# Altium schematic sheet USB suply_UART bridge.SchDoc
size A4; SheetNumber: 7; SheetTotal: 10
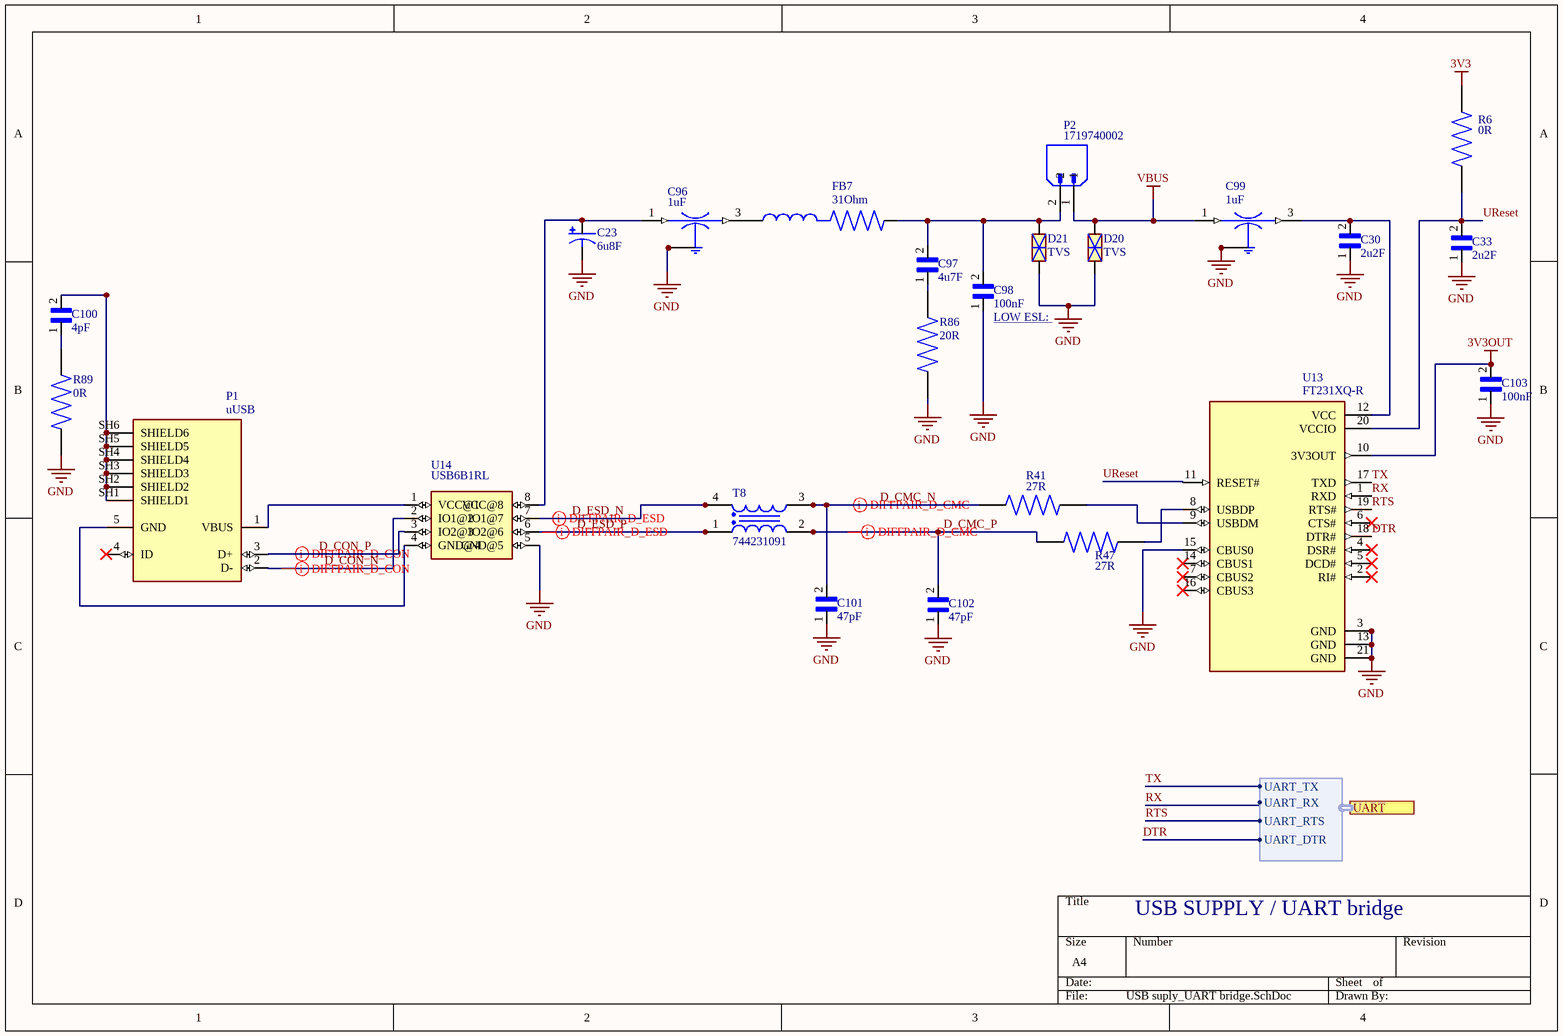
[diagram p0: USB suply_UART bridge.SchDoc]

## Parts
C23  6u8F  [2917(POL)]
C30  2u2F  [CAPC0603X35N]
C33  2u2F  [CAPC0603X35N]
C96  1uF  [FIL_NFM21PC105B1A3D]
C97  4u7F  [CAPC1608X100N]
C98  100nF  [CAPC0510X35N]
C99  1uF  [FIL_NFM21PC105B1A3D]
C100  4pF  [CAPC1005X55N]
C101  47pF  [CAPC1005X55N]
C102  47pF  [CAPC1005X55N]
C103  100nF  [CAPC0603X33N]
D20  TVS  [ST0201]
D21  TVS  [ST0201]
FB7  31Ohm  [FIL_NFZ32BW310HN11L]
P1  uUSB  [MOLEX_1050170001]
P2  1719740002  [MOLEX_1719740002]
R6  0R  [RESC1005X37N]
R41  27R  [RESC1005X40N]
R47  27R  [RESC1005X40N]
R86  20R  [RESC1005X40N]
R89  0R  [RESC1005X37N]
T8  744231091  [WE-CNSW_0805]
U13  FT231XQ-R  [QFN50P400X400X80-21N]
U14  USB6B1RL  [SOIC8]

## Ports
UART (harness UART, see System Overview[1B], External interfaces and connections[1C], Microcontroller[1A])

## Harnesses
UART: UART_TX, UART_RX, UART_RTS, UART_DTR

## Nets
3V3: R6.2
3V3OUT: C103.2 U13.10(3V3OUT)
GND: C23.2(NEG) C30.1 C33.1 C96.2(GND) C96.2_1(GND) C96.2_2(GND) C96.2_3(GND) C96.2_4(GND) C98.1 C99.2(GND) C99.2_1(GND) C99.2_2(GND) C99.2_3(GND) C99.2_4(GND) C101.1 C102.1 C103.1 D20.1 D21.1 R86.1 R89.1 U13.3(GND) U13.13(GND) U13.15(CBUS0) U13.21(GND) U14.5(GND@5)
VBUS: C99.1(IN) D20.2 P2.1
D_CMC_N: C101.2 R41.1 T8.3
D_CMC_P: C102.2 R47.1 T8.2
D_CON_N: P1.2(D-) U14.2(IO1@2)
D_CON_P: P1.3(D+) U14.3(IO2@3)
D_ESD_N: T8.4 U14.7(IO1@7)
D_ESD_P: T8.1 U14.6(IO2@6)
DTR: U13.18(DTR#) ; port UART.UART_DTR
RTS: U13.19(RTS#) ; port UART.UART_RTS
RX: U13.1(RXD) ; port UART.UART_RX
TX: U13.17(TXD) ; port UART.UART_TX
UReset: C33.2 R6.1 U13.11(RESET#) U13.20(VCCIO)
NetC23_1: C23.1(POS) C96.1(IN) U14.8(VCC@8)
NetC30_2: C30.2 C99.3(OUT) U13.12(VCC)
NetC96_3: C96.3(OUT) FB7.1
NetC97_1: C97.1 R86.2
NetC97_2: C97.2 C98.2 D21.2 FB7.2 P2.2
NetC100_1: C100.1 R89.2
NetC100_2: C100.2 P1.SH1(SHIELD1) P1.SH2(SHIELD2) P1.SH3(SHIELD3) P1.SH4(SHIELD4) P1.SH5(SHIELD5) P1.SH6(SHIELD6)
NetP1_1: P1.1(VBUS) U14.1(VCC@1)
NetP1_5: P1.5(GND) U14.4(GND@4)
NetR41_2: R41.2 U13.9(USBDM)
NetR47_2: R47.2 U13.8(USBDP)

Not connected (* = marked no-connect by the designer): P1 4(ID)*; U13 2(RI#)* 4(DSR#)* 5(DCD#)* 6(CTS#)* 7(CBUS2)* 14(CBUS1)* 16(CBUS3)*

## Layout directives
differential pair; differential pair class D_CON: D_CON_N, D_CON_P
differential pair; differential pair class D_ESD: D_ESD_N, D_ESD_P
differential pair; differential pair class D_CMC: D_CMC_N, D_CMC_P

## Notes on the sheet
- USB SUPPLY / UART bridge

## Library data of the parts
C23 = ECASD41C685M070K00: 6.8 µF 16 V Aluminum - Polymer Capacitors 2917 (7343 Metric) 70mOhm 1000 Hrs @ 105°C; MF: Murata; SnapEDA_Link: https://www.snapeda.com/parts/ECASD41C685M070K00/Murata/view-part/?ref=snap; Package: 2917 Murata; Value: *; MP: ECASD41C685M070K00; Check_prices: https://www.snapeda.com/parts/ECASD41C685M070K00/Murata/view-part/?ref=eda
C30 C33 = GRM033R60J225ME15D: SMD Capacitor X5R(EIA) with Capacitance: 2.2uF Tol. 20%. Rated Voltage: 6.3Vdc; Package: None; Price: None; Value: *; MP: GRM033R60J225ME15D; Availability: Unavailable
C96 C99 = NFM21PC105B1A3D: SMD Capacitor with Capacitance: 1.0uF Tol. 20%. Rated Voltage: 10Vdc; MF: Murata; Value: *; Package: NONSTANDARD; Price: None; MP: NFM21PC105B1A3D; Availability: Unavailable; SnapEDA_Link: https://www.snapeda.com/parts/NFM21PC105B1A3D/Murata/view-part/4380627/?ref=snap
C97 = GRM188R61A475KE15D: SMD Capacitor X5R(EIA) with Capacitance: 4.7uF Tol. 10%. Rated Voltage: 10Vdc; MF: Murata; MP: GRM188R61A475KE15D; Value: *; Availability: Bad; Package: 1608 Murata; SnapEDA_Link: https://www.snapeda.com/parts/GRM188R61A475KE15D/Murata%20Electronics%20North%20America/view-part/523427/?ref=snap; Price: None
C98 = LLL153C80J104ME01E: SMD Capacitor X6S(EIA) with Capacitance: 0.10uF Tol. 20%. Rated Voltage: 6.3Vdc; MF: Murata; Price: None; Value: *; Purchase-URL: https://pricing.snapeda.com/search/part/LLL153C80J104ME01E/?ref=eda; Package: 0510 Murata; SnapEDA_Link: https://www.snapeda.com/parts/LLL153C80J104ME01E/Murata/view-part/4376162/?ref=snap; Availability: Good; MP: LLL153C80J104ME01E
C100 = GRM1555C1H4R0CA01D: Cap Ceramic 4pF 50V C0G 0.25pF SMD 0402 125Â°C Paper T/R; Package: None; Price: None; Value: *; MP: GRM1555C1H4R0CA01D; Availability: Unavailable
C101 C102 = GRM1555C1H470FA01D: CAP, MLCC, C0G, 47PF, 50V, 0402; Package: None; Price: None; Value: *; MP: GRM1555C1H470FA01D; Availability: Unavailable
C103 = GRM033C80J104KE15D: SMD capacitor X6S(EIA) with capacitance 0.10uF Tol.10%. Rated voltage 6.3Vdc 105C; MF: Murata Electronics; Availability: In Stock; SnapEDA_Link: https://www.snapeda.com/parts/GRM033C80J104KE15D/Murata+Electronics+North+America/view-part/?ref=snap; Price: None; Check_prices: https://www.snapeda.com/parts/GRM033C80J104KE15D/Murata+Electronics+North+America/view-part/?ref=eda; Package: 0603 Taiyo Yuden; Purchase-URL: https://pricing.snapeda.com/search/part/GRM033C80J104KE15D/?ref=eda; MP: GRM033C80J104KE15D; Value: *
D20 D21 = ESDAXLC6-1BU2: 17V Clamp 1A (8/20Âµs) Ipp Tvs Diode Surface Mount ST0201; MF: STMicroelectronics; SnapEDA_Link: https://www.snapeda.com/parts/ESDAXLC6-1BU2/STMicroelectronics/view-part/?ref=snap; Package: 0201 STMicroelectronics; Value: *; MP: ESDAXLC6-1BU2; Check_prices: https://www.snapeda.com/parts/ESDAXLC6-1BU2/STMicroelectronics/view-part/?ref=eda
FB7 = NFZ32BW310HN11L: 31 Ohms @ 1MHz 1 Ferrite Bead 2-SMD, Flat Lead 1.2A 186mOhm; MF: Murata; Availability: Warning; MP: NFZ32BW310HN11L; Price: None; Value: *; SnapEDA_Link: https://www.snapeda.com/parts/NFZ32BW310HN11L/Murata/view-part/2726849/?ref=snap; Purchase-URL: https://pricing.snapeda.com/search/part/NFZ32BW310HN11L/?ref=eda; Package: SMD-2 Murata
P1 = 1050170001: USB - micro B USB 2.0 Receptacle Connector 5 Position Surface Mount, Right Angle; Through Hole; MF: Molex; SnapEDA_Link: https://www.snapeda.com/parts/1050170001/Molex/view-part/?ref=snap; Package: None; Value: *; MP: 1050170001; Check_prices: https://www.snapeda.com/parts/1050170001/Molex/view-part/?ref=eda
P2 = 1719740002: 2.54mm Pitch SL Header, Single Row, Right-Angle, LCP, Shrouded, Through Hole, Matte Tin (Sn) Plating, 2 Circuits; Availability: Unavailable; Price: None; Package: None; Value: *; MP: 1719740002
R6 R89 = RC0402JR-070RL: MF: {'manufacturer': u'YAGEO'}; Package: None; Price: None; Value: *; MP: RC0402JR-070RL; Availability: Unavailable
R41 R47 = RC0402FR-0727RL: Surface Mount Thick Film Resistor, RC Series, 27 ohm, 63 mW, - 1%, 50 V, 0402 [1005 Metric]; MF: Yageo; Digi-Key_Purchase_URL: https://www.digikey.com/product-detail/en/yageo/RC0402FR-0727RL/YAG3086CT-ND/5281951?utm_source=snapeda&utm_medium=aggregator&utm_campaign=symbol; Digi-Key_Part_Number: YAG3086CT-ND; Package: 1005 Panasonic Electronic Components; SnapEDA_Link: https://www.snapeda.com/parts/RC0402FR-0727RL/Yageo/view-part/938293/?ref=snap; MP: RC0402FR-0727RL; Value: *
R86 = RC0402JR-0720RL: 20 Ohms ±5% 0.063W, 1/16W Chip Resistor 0402 (1005 Metric) Moisture Resistant Thick Film; MF: Yageo; SnapEDA_Link: https://www.snapeda.com/parts/RC0402JR-0720RL/Yageo/view-part/?ref=snap; Package: 1005 Panasonic Electronic Components; Value: *; MP: RC0402JR-0720RL; Check_prices: https://www.snapeda.com/parts/RC0402JR-0720RL/Yageo/view-part/?ref=eda
T8 = CMP-0222-00046-2: NexarPartId: 22803305; Voltage Rating: 50V; Current Rating: 370mA; Test Frequency: 100MHz; Resistance: 300mΩ; Inductance: 131nH; Number of Lines: 2; Core Material: Ferrite; Impedance: 90Ω; Tolerance: 25%; Length: 2mm; Width: 1.2mm; Mount: Surface Mount; Ambient Temperature Range Low: -40°C; Current: 370mA; Voltage Rating (DC): 50V; DC Resistance (DCR): 300mΩ; Frequency: 100MHz; Voltage Rating (AC): 50V; Lead Free: Lead Free; Height: 1.2mm; Depth: 1.2mm; RoHS: Compliant; Termination: SMD/SMT; Number of Pins: 4; Case/Package: 0805; Min Operating Temperature: -40°C; Weight: 11.991848mg; Max Current Rating: 370mA; REACH SVHC: No SVHC; Packaging: Digi-Reel®; Max DC Current: 370mA; Ambient Temperature Range High: 85°C; Max Operating Temperature: 125°C
U13 = FT231XQ-R: USB2.0 Full Speed IC offers a compact bridge to full handshake UART Interface; Package: None; Price: None; Availability: Unavailable; MP: FT231XQ-R; Value: *
U14 = USB6B1RL: - Clamp - Ipp Tvs Diode Surface Mount 8-SOIC; MF: STMicroelectronics; SnapEDA_Link: https://www.snapeda.com/parts/USB6B1RL/STMicroelectronics/view-part/?ref=snap; Package: SOIC-8 STMicroelectronics; Value: *; MP: USB6B1RL; Check_prices: https://www.snapeda.com/parts/USB6B1RL/STMicroelectronics/view-part/?ref=eda